# Altium schematic sheet Mainboard_Encoder_Interface.SchDoc
size 381 x 254 mm
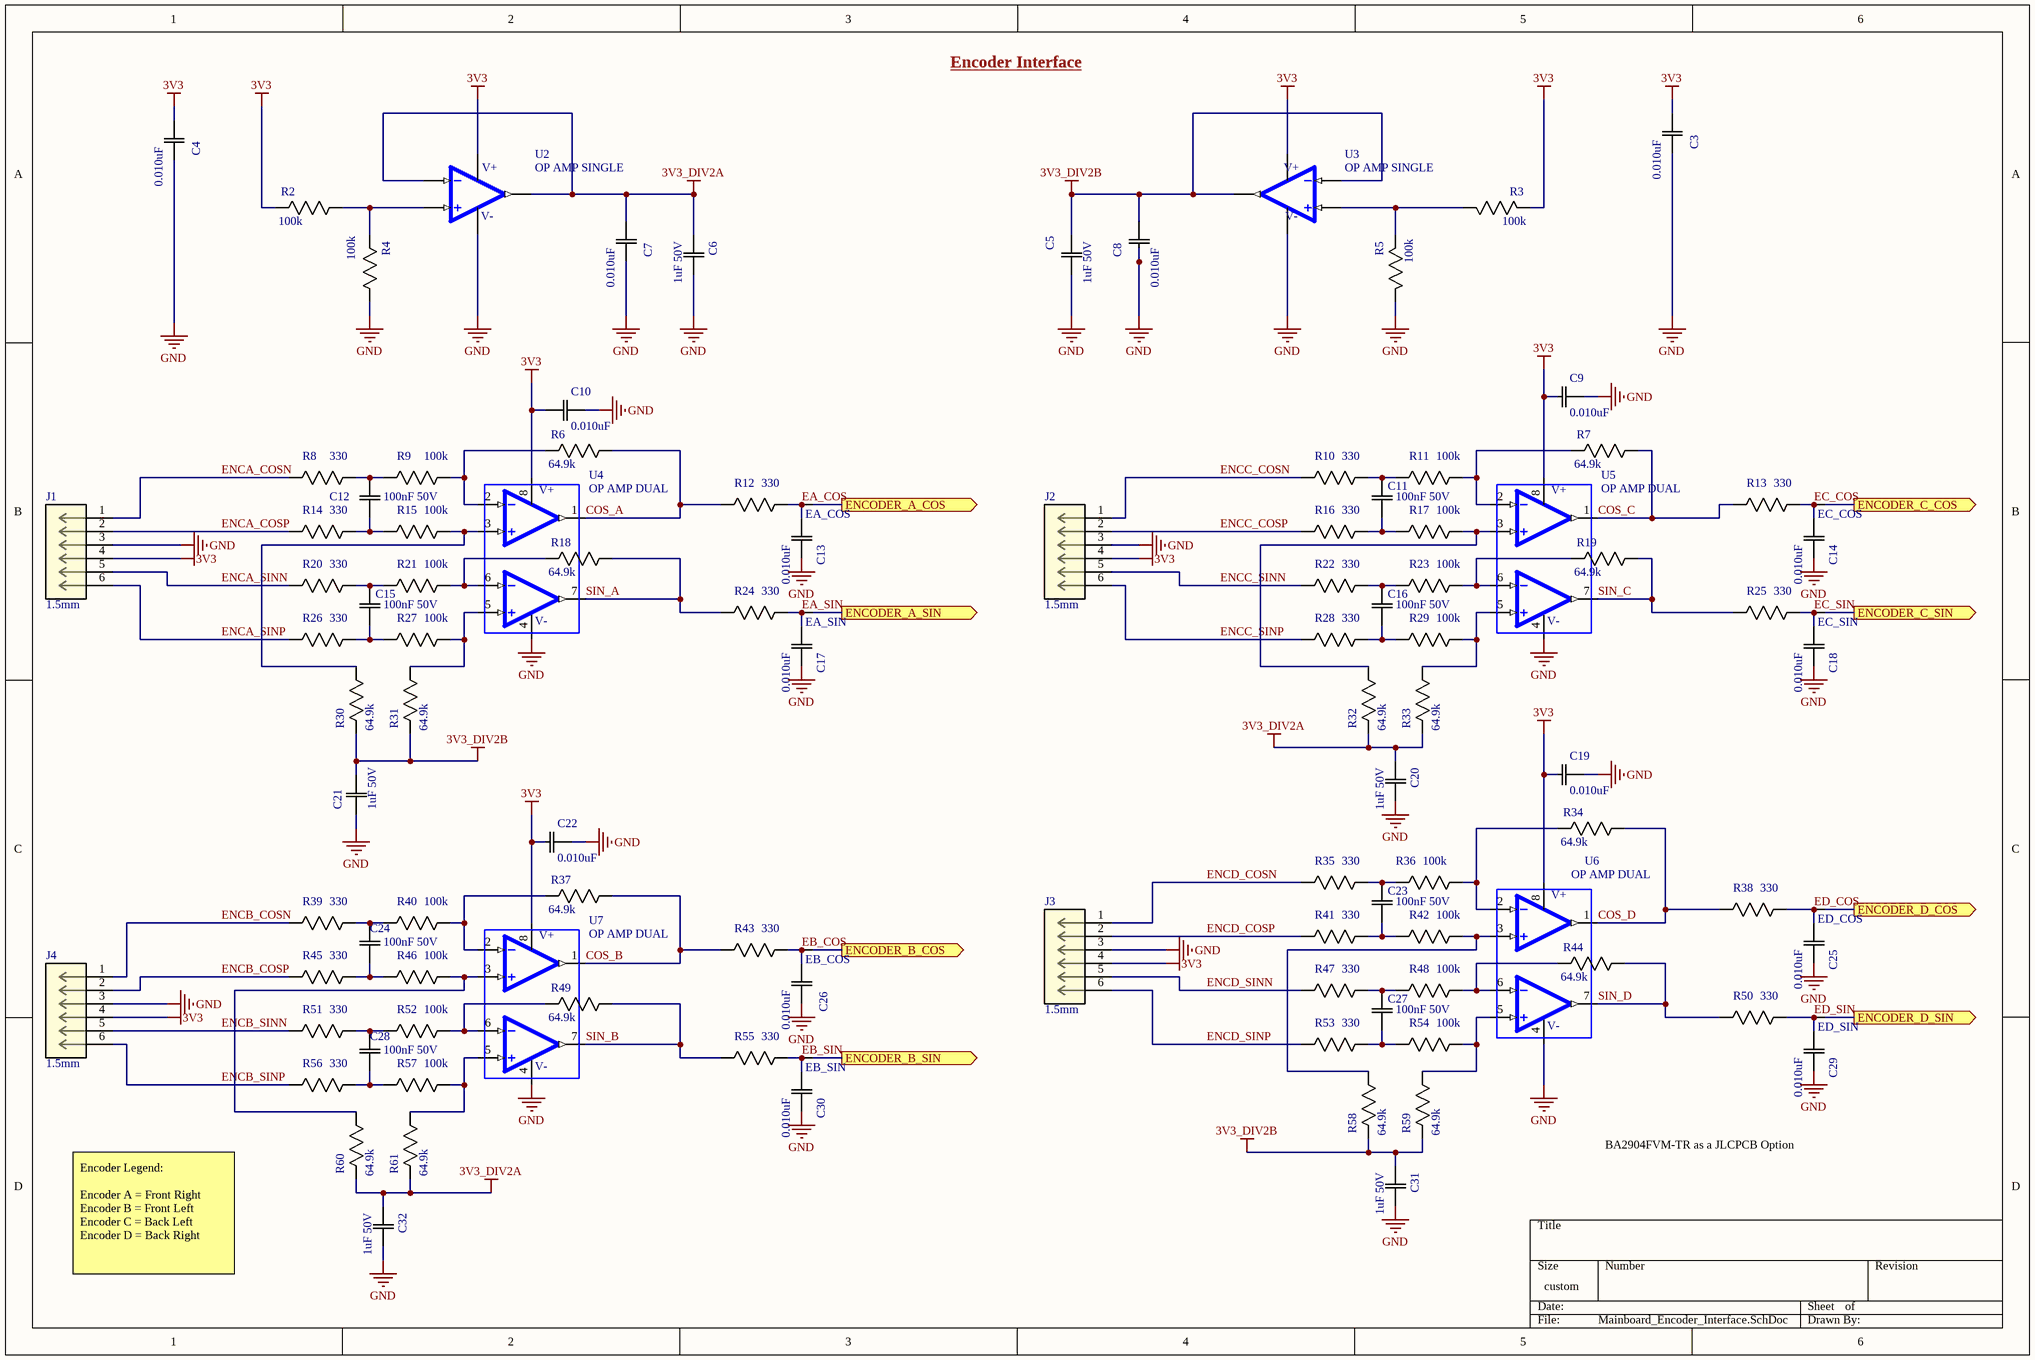
[diagram p0: Mainboard_Encoder_Interface.SchDoc]

## Parts
C3  0.010uF  [0603]
C4  0.010uF  [0603]
C5  1uF 50V  [0603]
C6  1uF 50V  [0603]
C7  0.010uF  [0603]
C8  0.010uF  [0603]
C9  0.010uF  [0603]
C10  0.010uF  [0603]
C11  100nF 50V  [0603]
C12  100nF 50V  [0603]
C13  0.010uF  [0603]
C14  0.010uF  [0603]
C15  100nF 50V  [0603]
C16  100nF 50V  [0603]
C17  0.010uF  [0603]
C18  0.010uF  [0603]
C19  0.010uF  [0603]
C20  1uF 50V  [0603]
C21  1uF 50V  [0603]
C22  0.010uF  [0603]
C23  100nF 50V  [0603]
C24  100nF 50V  [0603]
C25  0.010uF  [0603]
C26  0.010uF  [0603]
C27  100nF 50V  [0603]
C28  100nF 50V  [0603]
C29  0.010uF  [0603]
C30  0.010uF  [0603]
C31  1uF 50V  [0603]
C32  1uF 50V  [0603]
EA_COS  Test Point (Via)  [TP]  (value not drawn)
EA_SIN  Test Point (Via)  [TP]  (value not drawn)
EB_COS  Test Point (Via)  [TP]  (value not drawn)
EB_SIN  Test Point (Via)  [TP]  (value not drawn)
EC_COS  Test Point (Via)  [TP]  (value not drawn)
EC_SIN  Test Point (Via)  [TP]  (value not drawn)
ED_COS  Test Point (Via)  [TP]  (value not drawn)
ED_SIN  Test Point (Via)  [TP]  (value not drawn)
J1  1.5mm  [6POS JST Vertical]
J2  1.5mm  [6POS JST Vertical]
J3  1.5mm  [6POS JST Vertical]
J4  1.5mm  [6POS JST Vertical]
R2  100k  [0603]
R3  100k  [0603]
R4  100k  [0603]
R5  100k  [0603]
R6  64.9k  [0603]
R7  64.9k  [0603]
R8  330  [0603]
R9  100k  [0603]
R10  330  [0603]
R11  100k  [0603]
R12  330  [0603]
R13  330  [0603]
R14  330  [0603]
R15  100k  [0603]
R16  330  [0603]
R17  100k  [0603]
R18  64.9k  [0603]
R19  64.9k  [0603]
R20  330  [0603]
R21  100k  [0603]
R22  330  [0603]
R23  100k  [0603]
R24  330  [0603]
R25  330  [0603]
R26  330  [0603]
R27  100k  [0603]
R28  330  [0603]
R29  100k  [0603]
R30  64.9k  [0603]
R31  64.9k  [0603]
R32  64.9k  [0603]
R33  64.9k  [0603]
R34  64.9k  [0603]
R35  330  [0603]
R36  100k  [0603]
R37  64.9k  [0603]
R38  330  [0603]
R39  330  [0603]
R40  100k  [0603]
R41  330  [0603]
R42  100k  [0603]
R43  330  [0603]
R44  64.9k  [0603]
R45  330  [0603]
R46  100k  [0603]
R47  330  [0603]
R48  100k  [0603]
R49  64.9k  [0603]
R50  330  [0603]
R51  330  [0603]
R52  100k  [0603]
R53  330  [0603]
R54  100k  [0603]
R55  330  [0603]
R56  330  [0603]
R57  100k  [0603]
R58  64.9k  [0603]
R59  64.9k  [0603]
R60  64.9k  [0603]
R61  64.9k  [0603]
U2  OP AMP SINGLE  [SOT95P280X145-5N]
U3  OP AMP SINGLE  [SOT95P280X145-5N]
U4  OP AMP DUAL  [8-MSOP]
U5  OP AMP DUAL  [8-MSOP]
U6  OP AMP DUAL  [8-MSOP]
U7  OP AMP DUAL  [8-MSOP]

## Ports
ENCODER_A_COS (out), ENCODER_A_SIN (out), ENCODER_B_COS (out), ENCODER_B_SIN (out), ENCODER_C_COS (out), ENCODER_C_SIN (out), ENCODER_D_COS (out), ENCODER_D_SIN (out)

## Nets
3V3: C3.1(C1) C4.1(C1) C9.1(C1) C10.1(C1) C19.1(C1) C22.1(C1) J1.4 J2.4 J3.4 J4.4 R2.2(R2) R3.2(R2) U2.5(V+) U3.5(V+) U4.8(V+) U5.8(V+) U6.8(V+) U7.8(V+)
3V3_DIV2A: C6.1(C1) C7.1(C1) C20.1(C1) C32.1(C1) R32.2(R2) R33.2(R2) R60.2(R2) R61.2(R2) U2.1(OUT) U2.4(IN-)
3V3_DIV2B: C5.1(C1) C8.1(C1) C21.2(C2) C31.1(C1) R30.2(R2) R31.2(R2) R58.2(R2) R59.2(R2) U3.1(OUT) U3.4(IN-)
GND: C3.2(C2) C4.2(C2) C5.2(C2) C6.2(C2) C7.2(C2) C8.2(C2) C9.2(C2) C10.2(C2) C13.2(C2) C14.2(C2) C17.2(C2) C18.2(C2) C19.2(C2) C20.2(C2) C21.1(C1) C22.2(C2) C25.2(C2) C26.2(C2) C29.2(C2) C30.2(C2) C31.2(C2) C32.2(C2) J1.3 J2.3 J3.3 J4.3 R4.1(R1) R5.1(R1) U2.2(V-) U3.2(V-) U4.4(V-) U5.4(V-) U6.4(V-) U7.4(V-)
COS_A: R6.1(R1) R12.2(R2) U4.1(OUTA)
COS_B: R37.1(R1) R43.2(R2) U7.1(OUTA)
COS_C: R7.1(R1) R13.2(R2) U5.1(OUTA)
COS_D: R34.1(R1) R38.2(R2) U6.1(OUTA)
EA_COS: C13.1(C1) EA_COS.1 R12.1(R1) ; port ENCODER_A_COS
EA_SIN: C17.1(C1) EA_SIN.1 R24.1(R1) ; port ENCODER_A_SIN
EB_COS: C26.1(C1) EB_COS.1 R43.1(R1) ; port ENCODER_B_COS
EB_SIN: C30.1(C1) EB_SIN.1 R55.1(R1) ; port ENCODER_B_SIN
EC_COS: C14.1(C1) EC_COS.1 R13.1(R1) ; port ENCODER_C_COS
EC_SIN: C18.1(C1) EC_SIN.1 R25.1(R1) ; port ENCODER_C_SIN
ED_COS: C25.1(C1) ED_COS.1 R38.1(R1) ; port ENCODER_D_COS
ED_SIN: C29.1(C1) ED_SIN.1 R50.1(R1) ; port ENCODER_D_SIN
ENCA_COSN: J1.1 R8.2(R2)
ENCA_COSP: J1.2 R14.2(R2)
ENCA_SINN: J1.5 R20.2(R2)
ENCA_SINP: J1.6 R26.2(R2)
ENCB_COSN: J4.1 R39.2(R2)
ENCB_COSP: J4.2 R45.2(R2)
ENCB_SINN: J4.5 R51.2(R2)
ENCB_SINP: J4.6 R56.2(R2)
ENCC_COSN: J2.1 R10.2(R2)
ENCC_COSP: J2.2 R16.2(R2)
ENCC_SINN: J2.5 R22.2(R2)
ENCC_SINP: J2.6 R28.2(R2)
ENCD_COSN: J3.1 R35.2(R2)
ENCD_COSP: J3.2 R41.2(R2)
ENCD_SINN: J3.5 R47.2(R2)
ENCD_SINP: J3.6 R53.2(R2)
SIN_A: R18.1(R1) R24.2(R2) U4.7(OUTB)
SIN_B: R49.1(R1) R55.2(R2) U7.7(OUTB)
SIN_C: R19.1(R1) R25.2(R2) U5.7(OUTB)
SIN_D: R44.1(R1) R50.2(R2) U6.7(OUTB)
NetC11_1: C11.1(C1) R10.1(R1) R11.2(R2)
NetC11_2: C11.2(C2) R16.1(R1) R17.2(R2)
NetC12_1: C12.1(C1) R8.1(R1) R9.2(R2)
NetC12_2: C12.2(C2) R14.1(R1) R15.2(R2)
NetC15_1: C15.1(C1) R20.1(R1) R21.2(R2)
NetC15_2: C15.2(C2) R26.1(R1) R27.2(R2)
NetC16_1: C16.1(C1) R22.1(R1) R23.2(R2)
NetC16_2: C16.2(C2) R28.1(R1) R29.2(R2)
NetC23_1: C23.1(C1) R35.1(R1) R36.2(R2)
NetC23_2: C23.2(C2) R41.1(R1) R42.2(R2)
NetC24_1: C24.1(C1) R39.1(R1) R40.2(R2)
NetC24_2: C24.2(C2) R45.1(R1) R46.2(R2)
NetC27_1: C27.1(C1) R47.1(R1) R48.2(R2)
NetC27_2: C27.2(C2) R53.1(R1) R54.2(R2)
NetC28_1: C28.1(C1) R51.1(R1) R52.2(R2)
NetC28_2: C28.2(C2) R56.1(R1) R57.2(R2)
NetR2_1: R2.1(R1) R4.2(R2) U2.3(IN+)
NetR3_1: R3.1(R1) R5.2(R2) U3.3(IN+)
NetR6_2: R6.2(R2) R9.1(R1) U4.2(INA-)
NetR7_2: R7.2(R2) R11.1(R1) U5.2(INA-)
NetR15_1: R15.1(R1) R30.1(R1) U4.3(INA+)
NetR17_1: R17.1(R1) R32.1(R1) U5.3(INA+)
NetR18_2: R18.2(R2) R21.1(R1) U4.6(INB-)
NetR19_2: R19.2(R2) R23.1(R1) U5.6(INB-)
NetR27_1: R27.1(R1) R31.1(R1) U4.5(INB+)
NetR29_1: R29.1(R1) R33.1(R1) U5.5(INB+)
NetR34_2: R34.2(R2) R36.1(R1) U6.2(INA-)
NetR37_2: R37.2(R2) R40.1(R1) U7.2(INA-)
NetR42_1: R42.1(R1) R58.1(R1) U6.3(INA+)
NetR44_2: R44.2(R2) R48.1(R1) U6.6(INB-)
NetR46_1: R46.1(R1) R60.1(R1) U7.3(INA+)
NetR49_2: R49.2(R2) R52.1(R1) U7.6(INB-)
NetR54_1: R54.1(R1) R59.1(R1) U6.5(INB+)
NetR57_1: R57.1(R1) R61.1(R1) U7.5(INB+)

## Notes on the sheet
- Encoder Interface
- BA2904FVM-TR as a JLCPCB Option
- Encoder Legend:
  Encoder A = Front Right
  Encoder B = Front Left
  Encoder C = Back Left
  Encoder D = Back Right

## Library data of the parts
C3 C4 C7-C10 C13 C14 C17-C19 C22 C25 C26 C29 C30 = CAP 0.010uF 50V: CAP CER 0.010UF 50V X7R 0603/0805; Tolerance: 10%; Package: 0603/0805; Value: 0.010uF; Rating: 50V; Temperature Coefficient: X7R; Operating Temperature: -55°C ~ 125°C
C5 C6 C20 C21 C31 C32 = CAP 1uF 50V: CAP CER 1UF 50V X7R 0805; Tolerance: 10%; Package: 0805; Value: 1uF; Rating: 50V; Temperature Coefficient: X7R; Operating Temperature: -55°C ~ 125°C
C11 C12 C15 C16 C23 C24 C27 C28 = CAP 100nF 50V: CAP CER 0.1UF 50V X7R 0805; Tolerance: 10%; Package: 0805; Value: 100nF; Rating: 50V
J1-J4 = CN 6POS JST RA: Conn Shrouded Header HDR 6 POS 1.5mm Solder RA Thru-Hole Box; Manufacturer: JST; Manufacturer Part Number: S6B-ZR(LF)(SN); Body Plating: Tin; Number of Positions: 6; Current Rating: 1A; Connector Type: Header,Male Pin; Contact Resistance: 30mR; Voltage Rating: 50V; Gender: Male; Insulation Resistance: 500MR; Panel Thickness: 3.5mm; Supplier 1: Digi-Key; RoHS: Yes; Category: Headers and Wire Housings; Stock 1: 14808; Mount: Through Hole; Number of Pins: 6; Color: White; Contact Plating: Tin,Copper; Contact Material: Brass,Tin,Copper; Housing Color: Beige; Housing Material: Polyamide; Material: Nylon; Contact Shape: Circular; Insulation Material: Nylon; Insulation Color: Natural; Min Operating Temperature: -25°C; Max Operating Temperature: 85°C; Number of Rows: 1; Packaging: Bulk; Termination: Solder; Fastening Type: Detent; Number of Contacts: 6; Max Voltage Rating (AC): 50V; Max Current Rating: 1A; Orientation: Right Angle; Voltage Rating (AC): 50V; Voltage Rating (DC): 50V; Length: 10.5mm; Width: 3.5mm; Height: 7.2mm; Pitch: 1.5mm; Depth: 6mm; Lead Pitch: 1.5mm; Contact Mating Length: 0.094inch; Lead Free: Lead Free; Flammability Rating: UL94 V-0; REACH SVHC: No SVHC; ComponentLink1URL: https://datasheet.ciiva.com/8052/80556-8052225.pdf?src-supplier=Element14; ComponentLink1Description: https://datasheet.ciiva.com/8052/80556-8052225.pdf?src-supplier=Element14; ComponentLink2URL: https://datasheet.ciiva.com/25617/0900766b81147f94-25617345.pdf?src-supplier=RSComponents; ComponentLink2Description: https://datasheet.ciiva.com/25617/0900766b81147f94-25617345.pdf?src-supplier=RSComponents; ComponentLink3URL: https://datasheet.ciiva.com/11752/0900766b8082f593-11752194.pdf?src-supplier=RSComponents; ComponentLink3Description: https://datasheet.ciiva.com/11752/0900766b8082f593-11752194.pdf?src-supplier=RSComponents; ComponentLink4URL: https://datasheet.ciiva.com/26894/getdatasheetpartid-642095-26894637.pdf?src-supplier=Verical; ComponentLink4Description: https://datasheet.ciiva.com/26894/getdatasheetpartid-642095-26894637.pdf?src-supplier=Verical; ComponentLink5URL: https://datasheet.ciiva.com/712/ezh-712560.pdf?src-supplier=Digi-Key; ComponentLink5Description: https://datasheet.ciiva.com/712/ezh-712560.pdf?src-supplier=Digi-Key; ComponentLink6URL: https://datasheet.ciiva.com/16484/s6b-zrlfsn-16484554.pdf?src-supplier=Future+Electronics; ComponentLink6Description: https://datasheet.ciiva.com/16484/s6b-zrlfsn-16484554.pdf?src-supplier=Future+Electronics; Supplier Part Number 1: 455-1673-ND
R2-R5 R9 R11 R15 R17 R21 R23 R27 R29 R36 R40 R42 R46 R48 R52 R54 R57 = RES 100k 1/8W - 1%: RES SMD 100K OHM 1% 1/8W 0805; Power (Watts): 0.125W; Package: 0805; Value: 100k; Tolerance: 1%
R6 R7 R18 R19 R30-R34 R37 R44 R49 R58-R61 = RES 64.9k 1/8W: RES SMD 64.9K OHM 1% 1/8W 0805; Power (Watts): 0.125W; Package: 0805; Value: 64.9k; Tolerance: 1%; ComponentLink1Description: digikey; ComponentLink1URL: https://www.digikey.ca/en/products/detail/yageo/RC0805FR-0764K9L/728090
R8 R10 R12-R14 R16 R20 R22 R24-R26 R28 R35 R38 R39 R41 R43 R45 R47 R50 R51 R53 R55 R56 = RES 330.0 1/8W - 1%: RES SMD 330 OHM 1% 1/8W 0805; Rating: 0.125W; Package: 0805; Value: 330; Tolerance: 1%
U2 U3 = OP AMP SINGLE: ANALOG DEVICES - ADA4505-1ARJZ-R7 - IC, AMPLIF. OPER., R-R, CMOS, SOT23-5; Min Supply Voltage: 1.8V; Max Supply Voltage: 5V; Min Dual Supply Voltage: 900mV; Max Dual Supply Voltage: 2.5V; Voltage Gain: 120dB; Common Mode Rejection Ratio: 105dB; Gain Bandwidth Product: 50kHz; Slew Rate: 0.006V/µs; Operating Supply Voltage: 3V; Number of Circuits: 1; Input Bias Current: 500nA; Input Offset Voltage (Vos): 3mV; Operating Supply Current: 9uA; Output Current per Channel: 40mA; Power Supply Rejection Ratio (PSRR): 110dB; Input Capacitance: 4.7pF; Supplier 1: Digi-Key; Manufacturer: Analog Devices; Manufacturer Part Number: ADA4505-1ARJZ-R7; RoHS: Yes; Category: Amplifiers - Op Amps, Buffer, Instrumentation; Stock 1: 3416; Case/Package: SOT-23-5; Number of Pins: 5; Contact Plating: Tin,Matte; Min Operating Temperature: -40°C; Max Operating Temperature: 125°C; Bandwidth: 50kHz; Packaging: Tape and Reel; Package Quantity: 3000; Unity Gain Bandwidth Product: 50kHz; Number of Channels: 1; Number of Elements: 1; Number of Amplifiers: 1; Quiescent Current: 9uA; REACH SVHC: No SVHC; Lead Free: Contains Lead; ComponentLink1URL: https://datasheet.ciiva.com/22712/1610797-22712032.pdf?src-supplier=Element14; ComponentLink1Description: https://datasheet.ciiva.com/22712/1610797-22712032.pdf?src-supplier=Element14; ComponentLink2URL: https://datasheet.ciiva.com/23805/608874-23805844.pdf?src-supplier=Newark; ComponentLink2Description: https://datasheet.ciiva.com/23805/608874-23805844.pdf?src-supplier=Newark; ComponentLink3URL: https://datasheet.ciiva.com/1487/1610797-1487372.pdf?src-supplier=Element14; ComponentLink3Description: https://datasheet.ciiva.com/1487/1610797-1487372.pdf?src-supplier=Element14; Digikey: ADA4505-1ARJZ-R7CT-ND
U4-U7 = OP AMP DUAL: IC OPAMP VFB 50KHZ RRO 8MSOP; Manufacturer: Analog Devices; Manufacturer Part Number: ADA4505-2ARMZ; Common Mode Rejection Ratio: 105dB; Max Supply Voltage: 5V; Min Supply Voltage: 1.8V; Max Dual Supply Voltage: 2.5V; Min Dual Supply Voltage: 900mV; Voltage Gain: 120dB; Operating Supply Voltage: 3V; Slew Rate: 0.006V/µs; Input Offset Voltage (Vos): 3mV; Input Bias Current: 0.5pA; Operating Supply Current: 14uA; Number of Channels: 2; Power Supply Rejection Ratio (PSRR): 110dB; Output Current per Channel: 40mA; Quiescent Current: 7uA; Input Capacitance: 4.7pF; Supply Type: Single,Dual; RoHS: Yes; Category: Amplifiers - Op Amps, Buffer, Instrumentation; Stock 1: 767; Case/Package: MSOP; Number of Pins: 8; Contact Plating: Tin,Matte; Min Operating Temperature: -40°C; Max Operating Temperature: 125°C; Gain Bandwidth Product: 50kHz; Packaging: Rail/Tube; Package Quantity: 50; Unity Gain Bandwidth Product: 50kHz; Number of Circuits: 2; Number of Elements: 2; Number of Amplifiers: 2; Max Input Voltage: 5V; Nominal Supply Current: 7uA; Bandwidth: 50kHz; Length: 3.2mm; Width: 3.2mm; Height: 0.95mm; Lead Free: Contains Lead; REACH SVHC: No SVHC; ComponentLink1URL: https://datasheet.ciiva.com/24017/ada4505-1-4505-2-4505-4-249280-24017665.pdf?src-supplier=Mouser; ComponentLink1Description: https://datasheet.ciiva.com/24017/ada4505-1-4505-2-4505-4-249280-24017665.pdf?src-supplier=Mouser; ComponentLink2URL: https://datasheet.ciiva.com/2974/ada4505-1-4505-2-4505-4-2974772.pdf?src-supplier=Avnet; ComponentLink2Description: https://datasheet.ciiva.com/2974/ada4505-1-4505-2-4505-4-2974772.pdf?src-supplier=Avnet; ComponentLink3URL: https://datasheet.ciiva.com/17569/ada4505-1-4505-2-4505-4-17569270.pdf?src-supplier=Avnet+Europe; ComponentLink3Description: https://datasheet.ciiva.com/17569/ada4505-1-4505-2-4505-4-17569270.pdf?src-supplier=Avnet+Europe; ComponentLink4URL: https://datasheet.ciiva.com/1805/ada4505-1-4505-2-4505-4-1805784.pdf?src-supplier=Digi-Key; ComponentLink4Description: https://datasheet.ciiva.com/1805/ada4505-1-4505-2-4505-4-1805784.pdf?src-supplier=Digi-Key; Digikey: ADA4505-2ARMZ-ND